# Altium schematic sheet universky-POWER.SchDoc
size A4
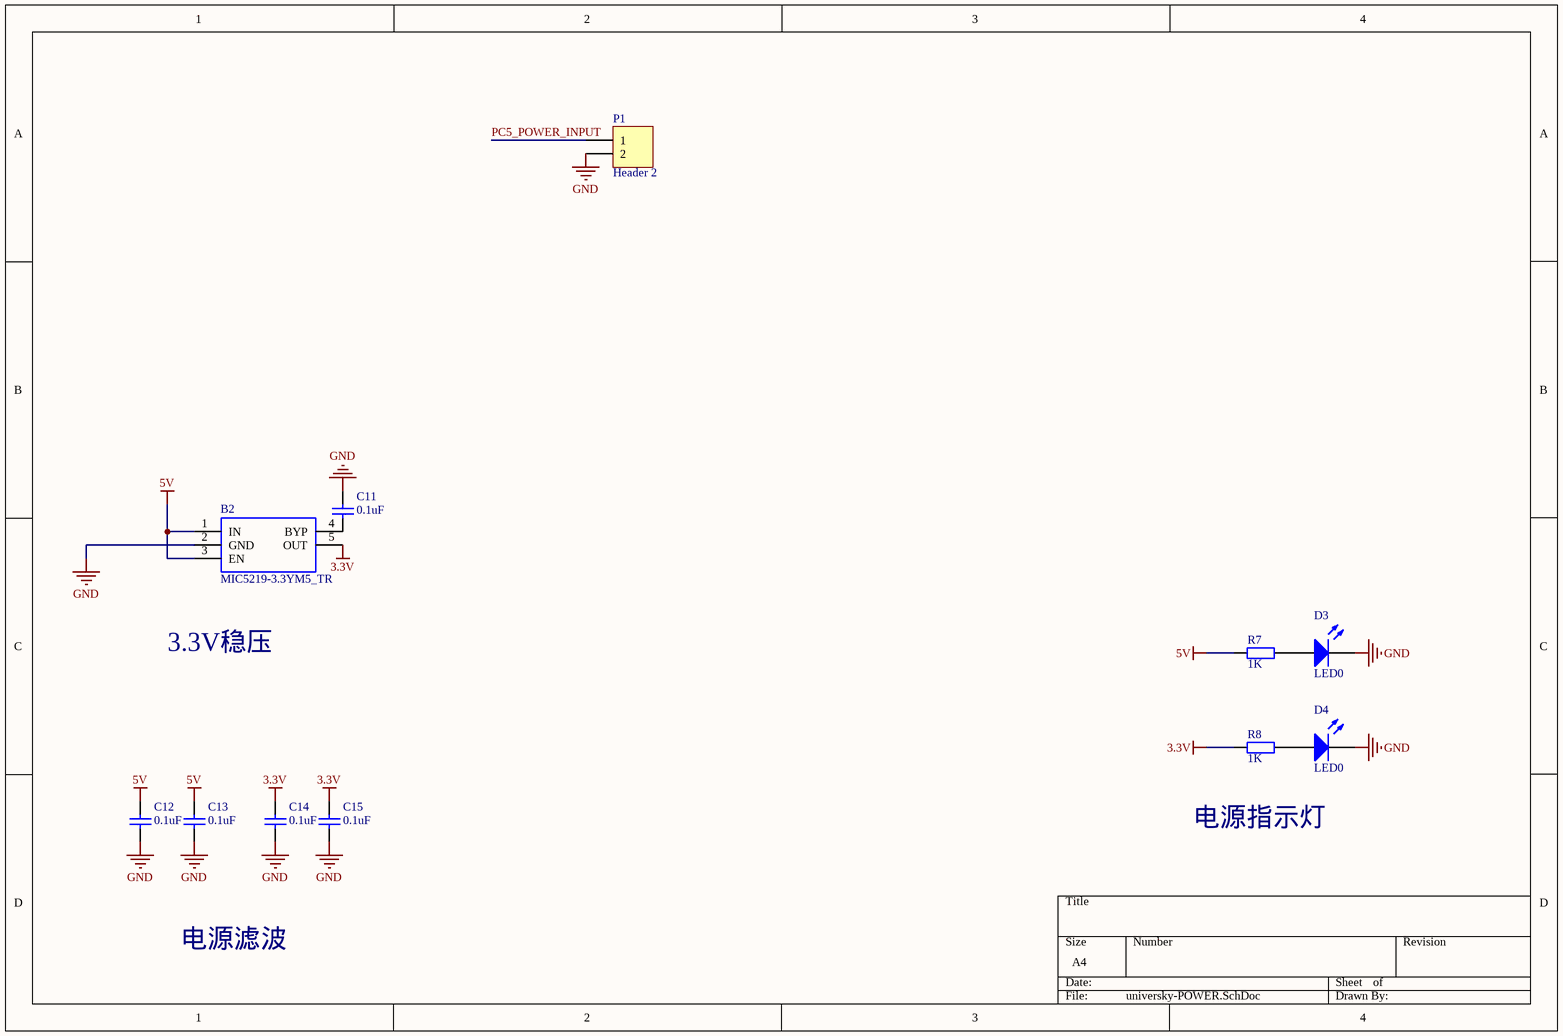
[diagram p0: universky-POWER.SchDoc]

## Parts
B2  MIC5219-3.3YM5_TR  [SOT95P280X145-5N]
C11  value 0.1uF  [0603_C]  (hidden comment: Cap)
C12  value 0.1uF  [0603_C]  (hidden comment: Cap)
C13  value 0.1uF  [0603_C]  (hidden comment: Cap)
C14  value 0.1uF  [0603_C]  (hidden comment: Cap)
C15  value 0.1uF  [0603_C]  (hidden comment: Cap)
D3  LED0  [0603_LED]
D4  LED0  [0603_LED]
P1  Header 2  [HDR1X2]
R7  value 1K  [0603_R]  (hidden comment: Res2)
R8  value 1K  [0603_R]  (hidden comment: Res2)

## Nets
3.3V: B2.5(OUT) C14.2 C15.2 R8.1
5V: B2.1(IN) B2.3(EN) C12.2 C13.2 R7.1
GND: B2.2(GND) C11.2 C12.1 C13.1 C14.1 C15.1 D3.2(K) D4.2(K) P1.2
PC5_POWER_INPUT: P1.1
NetB2_4: B2.4(BYP) C11.1
NetD3_1: D3.1(A) R7.2
NetD4_1: D4.1(A) R8.2

## Notes on the sheet
- 3.3V稳压
- 电源指示灯
- 电源滤波

## Library data of the parts
B2 = MIC5219-3.3YM5_TR: LDO Regulator Pos 3.3V 0.5A MIC5219-3.3YM5 TR, Low Dropout Voltage Regulator, 0.5A, 3.3 V ??1%, 2.5 ??? 12 Vin, 5-Pin SOT-23; Manufacturer_Name: Micrel; Allied_Number: R1033592; Geometry.Height: 1.45mm; Supplier_Name: RS; RS Part Number: 7272524; Manufacturer_Part_Number: MIC5219-3.3YM5 TR; Other Part Number: *; Datasheet Link: http://docs-europe.electrocomponents.com/webdocs/1385/0900766b8138542f.pdf; 3D Package: *
C11-C15 = Cap: Capacitor; Published: 8-Jun-2000; LatestRevisionDate: 17-Jul-2002; LatestRevisionNote: Re-released for DXP Platform.; PackageReference: RAD-0.3; Publisher: Altium Limited; PackageDescription: Radial Cap, Thru-Hole; 2 Leads; 0.3 in Pin Spacing
D3 D4 = LED0: Typical INFRARED GaAs LED; Published: 8-Jun-2000; LatestRevisionDate: 08-Jul-2005; LatestRevisionNote: Mech Layer 1 removed.; PackageReference: LED-0; Publisher: Altium Limited; PackageDescription: LED; 2 Leads
P1 = Header 2: Header, 2-Pin; LatestRevisionDate: 17-Jul-2002; LatestRevisionNote: Re-released for DXP Platform.; Publisher: Altium Limited
R7 R8 = Res2: Resistor; Published: 8-Jun-2000; LatestRevisionDate: 17-Jul-2002; LatestRevisionNote: Re-released for DXP Platform.; PackageReference: AXIAL-0.4; Publisher: Altium Limited; PackageDescription: Axial Device, Thru-Hole; 2 Leads; 0.4 in Pin Spacing